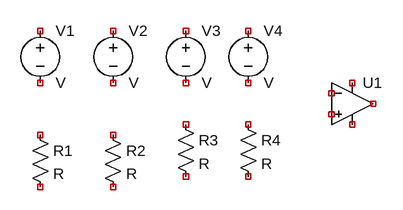
[diagram p0: schematic Draft1.asc]
Draft1.asc, the LTspice schematic file:
Version 4
SHEET 1 880 680
SYMBOL voltage 16 64 R0
SYMATTR InstName V1
SYMBOL voltage 128 64 R0
SYMATTR InstName V2
SYMBOL voltage 240 64 R0
SYMATTR InstName V3
SYMBOL voltage 336 64 R0
SYMATTR InstName V4
SYMBOL res 0 224 R0
SYMATTR InstName R1
SYMBOL res 112 224 R0
SYMATTR InstName R2
SYMBOL res 224 208 R0
SYMATTR InstName R3
SYMBOL res 320 208 R0
SYMATTR InstName R4
SYMBOL Opamps\\UniversalOpamp2 496 192 R0
SYMATTR InstName U1

The netlist it stands for:
* Draft1.asc
V1 NC_01 NC_02 V
V2 NC_03 NC_04 V
V3 NC_05 NC_06 V
V4 NC_07 NC_08 V
R1 NC_09 NC_10 R
R2 NC_11 NC_12 R
R3 NC_13 NC_14 R
R4 NC_15 NC_16 R
XU1 NC_17 NC_18 NC_19 NC_20 NC_21 level.2 Avol=1Meg GBW=10Meg Slew=10Meg ilimit=25m rail=0 Vos=0 phimargin=45 en=0 enk=0 in=0 ink=0 Rin=500Meg  ; pins IN+ IN- V+ V- OUT
.lib UniversalOpamps2.sub
.backanno
.end